# EAGLE schematic control_board_final (EAGLE 8.2.1)
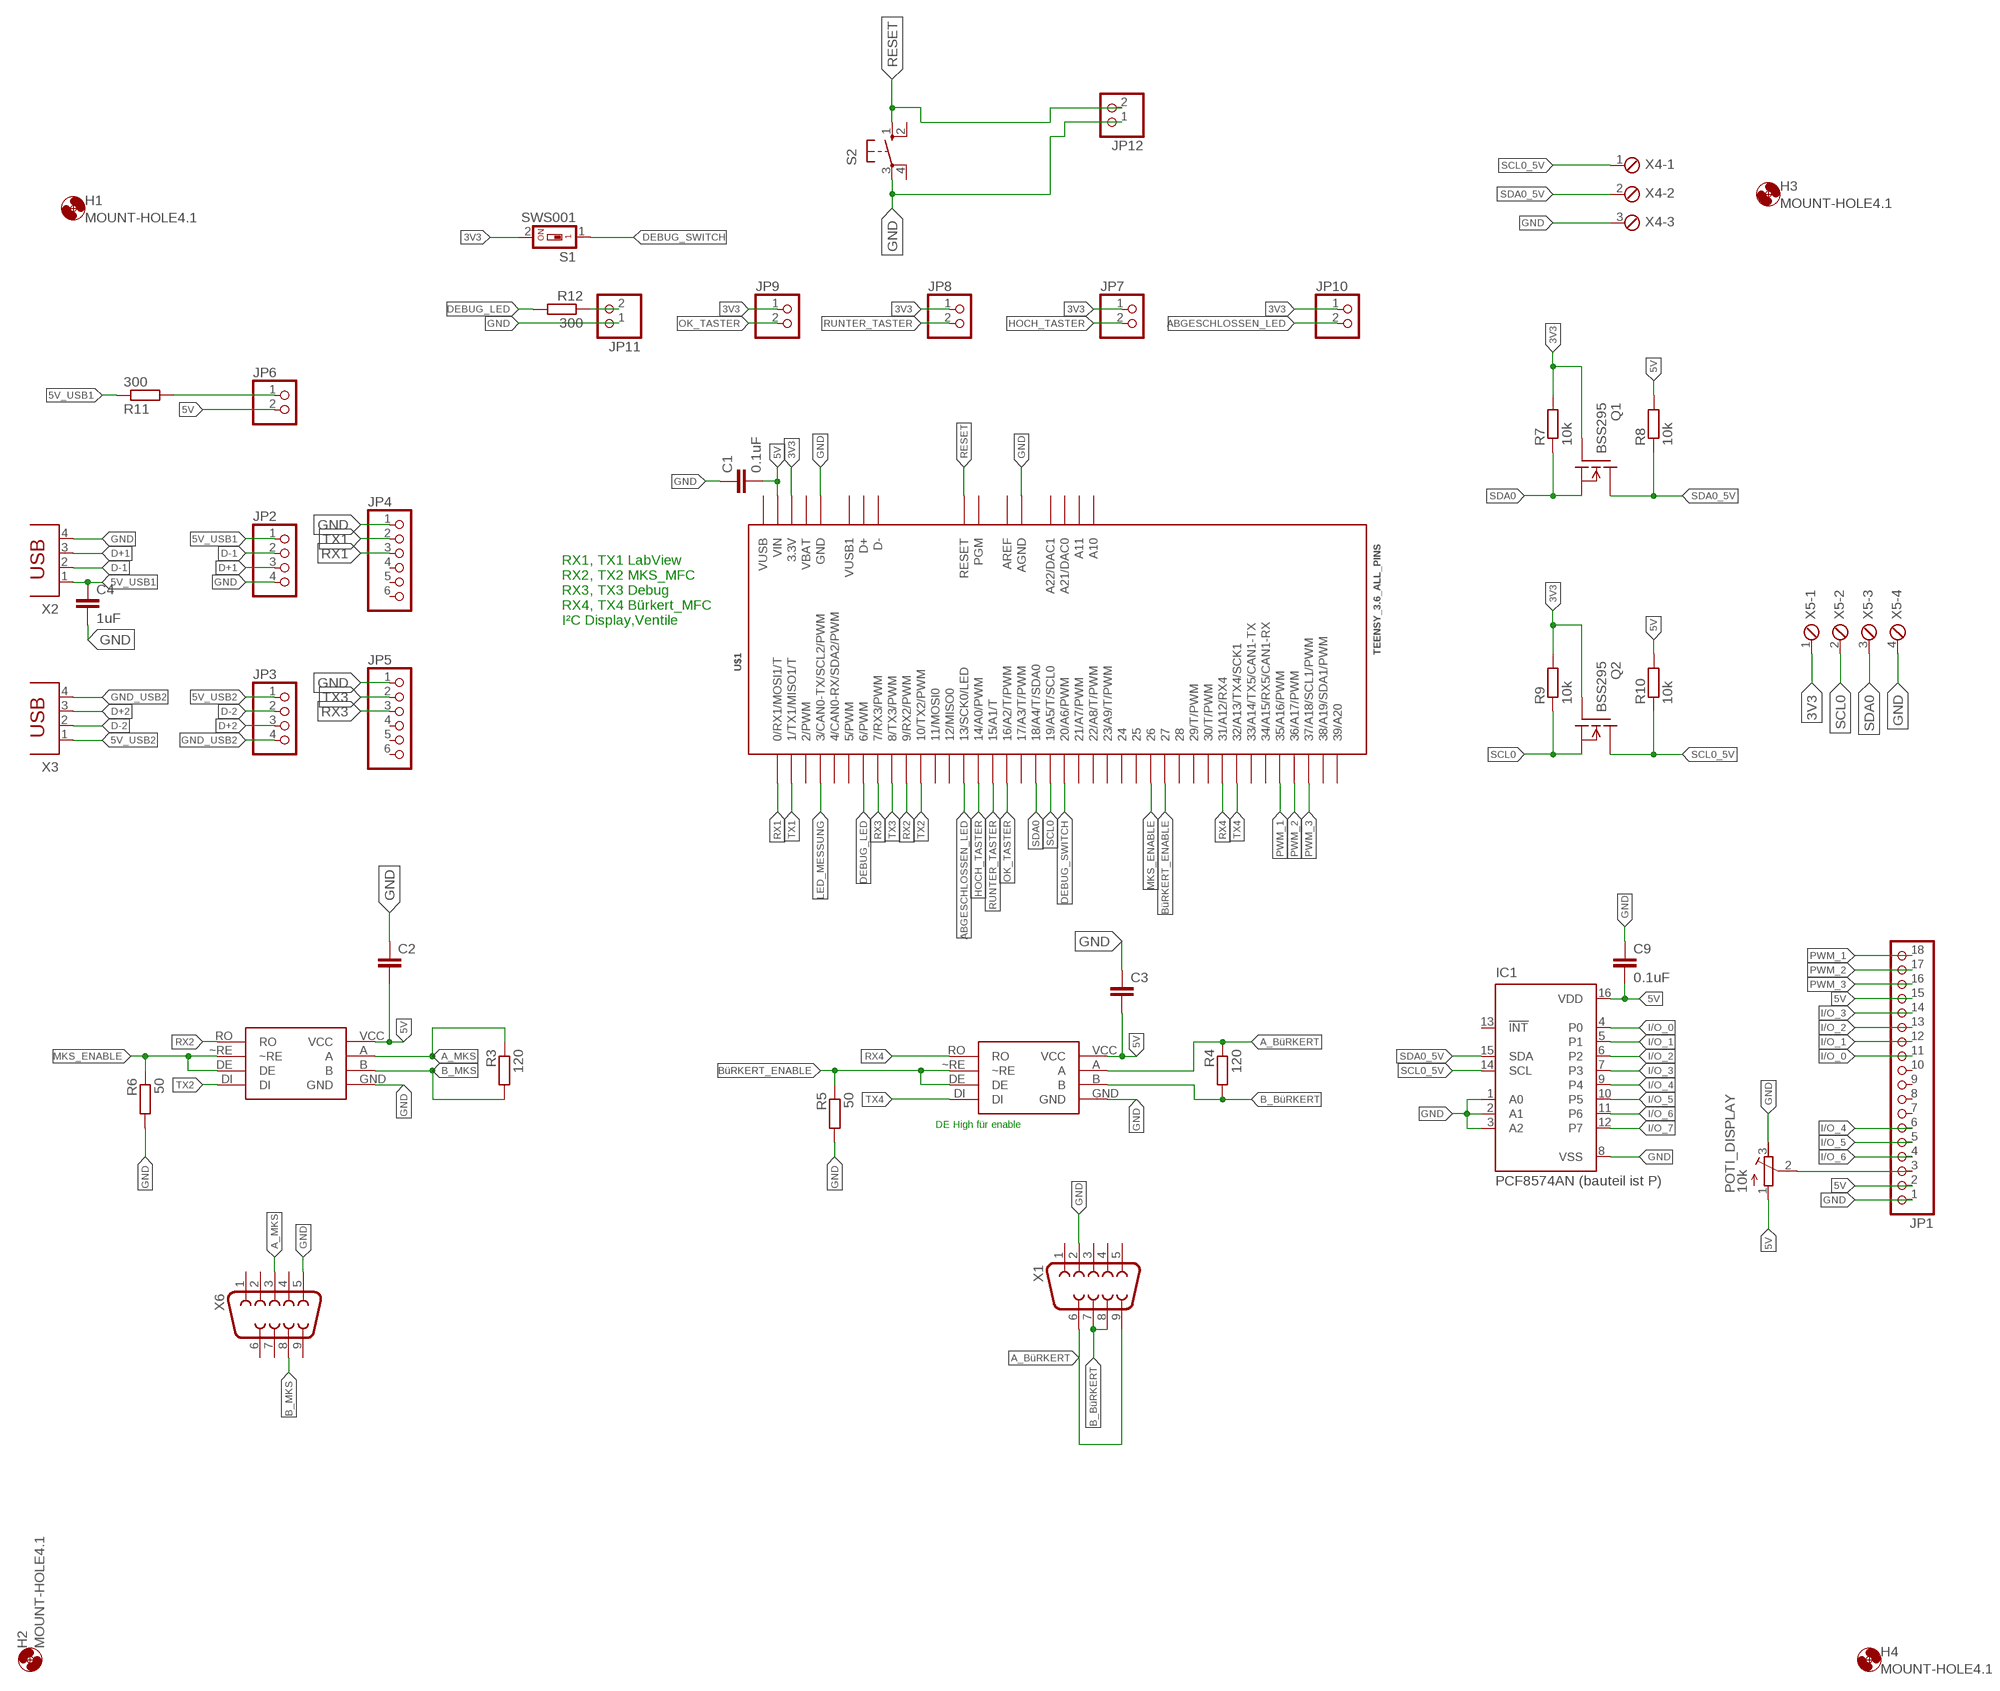
[diagram p0: schematic, sheet 1]

## Parts
C1  0.1uF  C-EUC0805  [C0805]
C2  C-EUC0805  [C0805]
C3  C-EUC0805  [C0805]
C4  1uF  C-EUC0805  [C0805]
C9  0.1uF  C-EUC0805  [C0805]
H1  MOUNT-HOLE4.1  [4,1]
H2  MOUNT-HOLE4.1  [4,1]
H3  MOUNT-HOLE4.1  [4,1]
H4  MOUNT-HOLE4.1  [4,1]
IC1  PCF8574AN (bauteil ist P)  PCF8574P  [DIL16]
JP1  PINHD-1X18  [1X18]
JP2  PINHD-1X4  [1X04]
JP3  PINHD-1X4  [1X04]
JP4  PINHD-1X6  [1X06]
JP5  PINHD-1X6  [1X06]
JP6  PINHD-1X2  [1X02]
JP7  PINHD-1X2  [1X02]
JP8  PINHD-1X2  [1X02]
JP9  PINHD-1X2  [1X02]
JP10  PINHD-1X2  [1X02]
JP11  PINHD-1X2  [1X02]
JP12  PINHD-1X2  [1X02]
POTI_DISPLAY  10k  R-TRIMM3374  [RTRIM3374]
Q1  BSS295  [TO92]
Q2  BSS295  [TO92]
R3  120  R-EU_R0805  [R0805]
R4  120  R-EU_R0805  [R0805]
R5  50  R-EU_R0805  [R0805]
R6  50  R-EU_R0805  [R0805]
R7  10k  R-EU_VMTA55  [VMTA55]
R8  10k  R-EU_VMTA55  [VMTA55]
R9  10k  R-EU_VMTA55  [VMTA55]
R10  10k  R-EU_VMTA55  [VMTA55]
R11  300  R-EU_R0805  [R0805]
R12  300  R-EU_R0805  [R0805]
S1  SWS001  [SMS-001]
S2  10-XX  [B3F-10XX]
U$1  TEENSY_3.6_ALL_PINS  [TEENSY_3.6_ALL_PINS]
U$5  MAX14775EASA+  [SO08]
U$6  MAX14775EASA+  [SO08]
X1  F09HP  [F09HP]
X2  PN61729  [PN61729]
X3  PN61729  [PN61729]
X4  MPT3  [3POL254]
X5  MPT4  [4POL254]
X6  F09HP  [F09HP]

## Nets
3V3: JP7.1 JP8.1 JP9.1 JP10.1 Q1.1(G) Q2.1(G) R7.2 R9.2 S1.2 U$1.3.3V U$1.3.3V3(3.3V) U$1.3.3V4(3.3V) X5.1
5V: C1.2 C2.2 C3.2 C9.2 IC1.16(VDD) JP1.2 JP1.15 JP6.2 POTI_DISPLAY.1(A) R8.2 R10.2 U$1.VIN U$5.VCC U$6.VCC
5V_USB1: C4.1 JP2.1 R11.1 X2.1
5V_USB2: JP3.1 X3.1
A_BüRKERT: R4.1 U$5.A X1.6 X1.9
A_MKS: R3.1 U$6.A X6.3
ABGESCHLOSSEN_LED: JP10.2 U$1.13(13/SCK0/LED)
B_BüRKERT: R4.2 U$5.B X1.7 X1.8
B_MKS: R3.2 U$6.B X6.8
BüRKERT_ENABLE: R5.1 U$1.27 U$5.DE U$5.~RE
D+1: JP2.3 X2.3
D+2: JP3.3 X3.3
D-1: JP2.2 X2.2
D-2: JP3.2 X3.2
DEBUG_LED: R12.2 U$1.6(6/PWM)
DEBUG_SWITCH: S1.1 U$1.20/A6(20/A6/PWM)
GND: C1.1 C2.1 C3.1 C4.2 C9.1 IC1.1(A0) IC1.2(A1) IC1.3(A2) IC1.8(VSS) JP1.1 JP2.4 JP4.1 JP5.1 JP11.1 JP12.1 POTI_DISPLAY.3(E) R5.2 R6.2 S2.3(P) U$1.AGND U$1.GND U$1.GND1(GND) U$1.GND3(GND) U$1.GND4(GND) U$1.GND6(GND) U$5.GND U$6.GND X1.2 X2.4 X4.3 X5.4 X6.5
GND_USB2: JP3.4 X3.4
HOCH_TASTER: JP7.2 U$1.14/A0(14/A0/PWM)
I/O_0: IC1.4(P0) JP1.11
I/O_1: IC1.5(P1) JP1.12
I/O_2: IC1.6(P2) JP1.13
I/O_3: IC1.7(P3) JP1.14
I/O_4: IC1.9(P4) JP1.6
I/O_5: IC1.10(P5) JP1.5
I/O_6: IC1.11(P6) JP1.4
I/O_7: IC1.12(P7)
LED_MESSUNG: U$1.3(3/CAN0-TX/SCL2/PWM)
MKS_ENABLE: R6.1 U$1.26 U$6.DE U$6.~RE
N$1: JP6.1 R11.2
N$2: JP11.2 R12.1
OK_TASTER: JP9.2 U$1.16/A2(16/A2/T/PWM)
POTI: JP1.3 POTI_DISPLAY.2(S)
PWM_1: JP1.18 U$1.35/A16(35/A16/PWM)
PWM_2: JP1.17 U$1.36/A17(36/A17/PWM)
PWM_3: JP1.16 U$1.37/A18(37/A18/SCL1/PWM)
RESET: JP12.2 S2.1(S) U$1.RESET
RUNTER_TASTER: JP8.2 U$1.15/A1(15/A1/T)
RX1: JP4.3 U$1.0(0/RX1/MOSI1/T)
RX2: U$1.9(9/RX2/PWM) U$6.RO
RX3: JP5.3 U$1.7(7/RX3/PWM)
RX4: U$1.31/A12(31/A12/RX4) U$5.RO
SCL0: Q2.3(S) R9.1 U$1.19/A5(19/A5/T/SCL0) X5.2
SCL0_5V: IC1.14(SCL) Q2.2(D) R10.1 X4.1
SDA0: Q1.3(S) R7.1 U$1.18/A4(18/A4/T/SDA0) X5.3
SDA0_5V: IC1.15(SDA) Q1.2(D) R8.1 X4.2
TX1: JP4.2 U$1.1(1/TX1/MISO1/T)
TX2: U$1.10(10/TX2/PWM) U$6.DI
TX3: JP5.2 U$1.8(8/TX3/PWM)
TX4: U$1.32/A13(32/A13/TX4/SCK1) U$5.DI
Unconnected: IC1.13(!INT) JP1.7 JP1.8 JP1.9 JP1.10 JP4.4 JP4.5 JP4.6 JP5.4 JP5.5 JP5.6 S2.2(S1) S2.4(P1) U$1.2(2/PWM) U$1.4(4/CAN0-RX/SDA2/PWM) U$1.5(5/PWM) U$1.11(11/MOSI0) U$1.12(12/MISO0) U$1.17/A3(17/A3/T/PWM) U$1.21/A7(21/A7/PWM) U$1.22/A8(22/A8/T/PWM) U$1.23/A9(23/A9/T/PWM) U$1.24 U$1.25 U$1.28 U$1.29(29/T/PWM) U$1.30(30/T/PWM) U$1.33/A14(33/A14/TX5/CAN1-TX) U$1.34/A15(34/A15/RX5/CAN1-RX) U$1.38/A19(38/A19/SDA1/PWM) U$1.39/A20 U$1.A10 U$1.A11 U$1.A21(A21/DAC0) U$1.A22(A22/DAC1) U$1.D+ U$1.D- U$1.PGM X1.1 X1.3 X1.4 X1.5 X6.1 X6.2 X6.4 X6.6 X6.7 X6.9

## Notes on the sheet
- RX1, TX1 LabView
  RX2, TX2 MKS_MFC
  RX3, TX3 Debug
  RX4, TX4 Bürkert_MFC
  I²C Display,Ventile
- DE High für enable

## Power pins joined to a net without a drawn wire
AREF: U$1.AREF
VBAT: U$1.VBAT
VUSB: U$1.VUSB
VUSB1: U$1.VUSB1

## Library data of the parts
C1-C4 C9 = rcl:C-EU: CAPACITOR, European symbol
H1-H4 = holes:MOUNT-HOLE: MOUNTING HOLE with drill center marker
IC1 = micro-philips:PCF8574: I2C-Bus Remote 8-bit I/O expander http://www.semiconductors.philips.com/acrobat_download/datasheets/PCF8574_4.pdf; MPN: PCF8574PN; OC_FARNELL: 204020; OC_NEWARK: 11N8515
JP1 = pinhead:PINHD-1X18: PIN HEADER
JP2 JP3 = pinhead:PINHD-1X4: PIN HEADER
JP4 JP5 = pinhead:PINHD-1X6: PIN HEADER
JP6-JP12 = pinhead:PINHD-1X2: PIN HEADER
POTI_DISPLAY = rcl:R-TRIMM: Trimm resistor
Q1 Q2 = transistor-fet:BSS295: N-Channel Enhancement MOSFET not checked
R3-R12 = rcl:R-EU_: RESISTOR, European symbol
S1 = smd-special:SWS001: SMD Dip Switch 1 pol.
S2 = switch-omron:10-XX: OMRON SWITCH; MPN: B3F-1000; OC_FARNELL: 176432; OC_NEWARK: 36M3542
U$1 = Teensy_3_and_LC_Series_Boards_v1.4:TEENSY_3.6_ALL_PINS: All PIN version of the Teensy 3.6.
U$5 U$6 = own_MAX14775EASA+:MAX14775EASA+
X1 X6 = con-subd:F09: SUB-D; OC_FARNELL: unknown; OC_NEWARK: unknown
X2 X3 = con-berg:PN61729: BERG USB connector; OC_FARNELL: unknown; OC_NEWARK: unknown
X4 = con-phoenix-254:MPT3: PHOENIX CONNECTOR; OC_FARNELL: unknown; OC_NEWARK: unknown
X5 = con-phoenix-254:MPT4: PHOENIX CONNECTOR; OC_FARNELL: unknown; OC_NEWARK: unknown